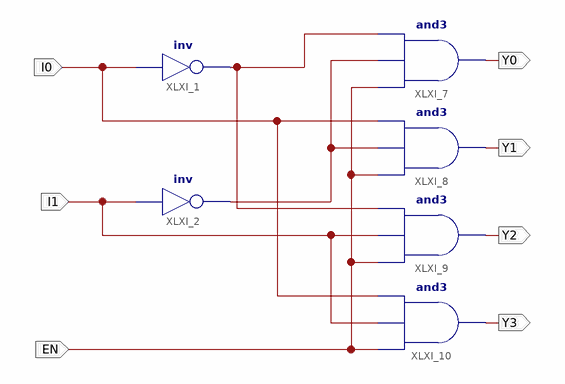
[diagram p0: schematic sheet 1]
// Xilinx ISE schematic Decoder_2_to_4.sch (spartan3e) as structural Verilog: 6 symbols, 7 ports
module Decoder_2_to_4 (
  input  I0,
  input  EN,
  input  I1,
  output Y0,
  output Y1,
  output Y2,
  output Y3
);

  wire XLXN_4, XLXN_8;

  not XLXI_1 (XLXN_8, I0);
  not XLXI_2 (XLXN_4, I1);
  and XLXI_7 (Y0, EN, XLXN_4, XLXN_8);
  and XLXI_8 (Y1, EN, XLXN_4, I0);
  and XLXI_9 (Y2, EN, I1, XLXN_8);
  and XLXI_10 (Y3, EN, I1, I0);
endmodule
